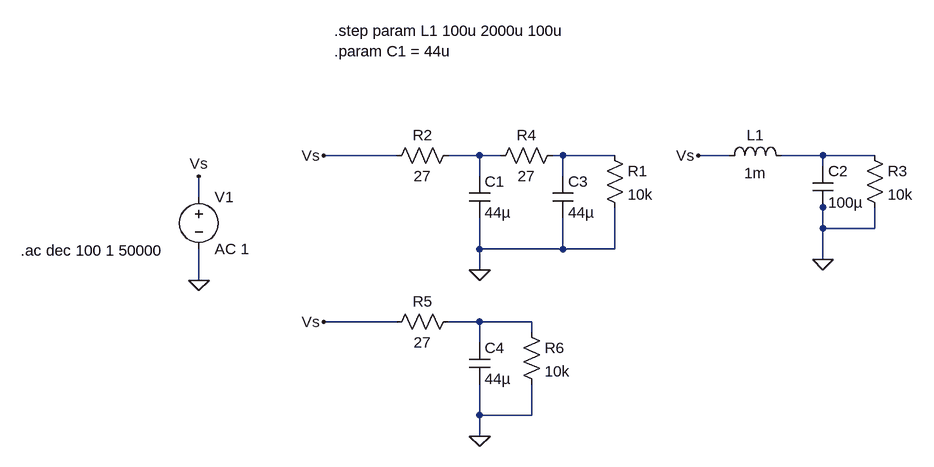
[diagram p0: schematic PowerFilter.asc]
PowerFilter.asc, the LTspice schematic file:
Version 4
SHEET 1 984 680
WIRE 112 48 0 48
WIRE 240 48 192 48
WIRE 272 48 240 48
WIRE 368 48 352 48
WIRE 448 48 368 48
WIRE 624 48 576 48
WIRE 768 48 704 48
WIRE 848 48 768 48
WIRE 768 64 768 48
WIRE 240 80 240 48
WIRE 368 80 368 48
WIRE -192 112 -192 80
WIRE 768 128 768 112
WIRE 768 160 768 128
WIRE 848 160 848 128
WIRE 848 160 768 160
WIRE 240 192 240 144
WIRE 368 192 368 144
WIRE 368 192 240 192
WIRE 448 192 448 128
WIRE 448 192 368 192
WIRE 768 208 768 160
WIRE 240 224 240 192
WIRE -192 240 -192 192
WIRE 112 304 0 304
WIRE 240 304 192 304
WIRE 320 304 240 304
WIRE 320 320 320 304
WIRE 240 336 240 304
WIRE 240 448 240 400
WIRE 320 448 320 400
WIRE 320 448 240 448
WIRE 240 480 240 448
FLAG 240 224 0
FLAG -192 240 0
FLAG -192 80 Vs
FLAG 0 48 Vs
FLAG 768 208 0
FLAG 576 48 Vs
FLAG 240 480 0
FLAG 0 304 Vs
SYMBOL voltage -192 96 R0
WINDOW 123 0 0 Left 2
WINDOW 39 0 0 Left 2
SYMATTR InstName V1
SYMATTR Value AC 1
SYMBOL cap 224 80 R0
SYMATTR InstName C1
SYMATTR Value 44µ
SYMBOL res 432 32 R0
SYMATTR InstName R1
SYMATTR Value 10k
SYMBOL res 208 32 R90
WINDOW 0 0 56 VBottom 2
WINDOW 3 32 56 VTop 2
SYMATTR InstName R2
SYMATTR Value 27
SYMBOL ind 608 64 R270
WINDOW 0 32 56 VTop 2
WINDOW 3 5 56 VBottom 2
SYMATTR InstName L1
SYMATTR Value 1m
SYMBOL cap 752 64 R0
SYMATTR InstName C2
SYMATTR Value 100µ
SYMBOL res 832 32 R0
SYMATTR InstName R3
SYMATTR Value 10k
SYMBOL res 368 32 R90
WINDOW 0 0 56 VBottom 2
WINDOW 3 32 56 VTop 2
SYMATTR InstName R4
SYMATTR Value 27
SYMBOL cap 352 80 R0
SYMATTR InstName C3
SYMATTR Value 44µ
SYMBOL cap 224 336 R0
SYMATTR InstName C4
SYMATTR Value 44µ
SYMBOL res 208 288 R90
WINDOW 0 0 56 VBottom 2
WINDOW 3 32 56 VTop 2
SYMATTR InstName R5
SYMATTR Value 27
SYMBOL res 304 304 R0
SYMATTR InstName R6
SYMATTR Value 10k
TEXT -466 194 Left 2 !.ac dec 100 1 50000
TEXT 16 -144 Left 2 !.step param L1 100u 2000u 100u\n.param C1 = 44u

The netlist it stands for:
* PowerFilter.asc
V1 Vs 0 AC 1
C1 N001 0 44µ
R1 N002 0 10k
R2 N001 Vs 27
L1 Vs N003 1m
C2 N003 0 100µ
R3 N003 0 10k
R4 N002 N001 27
C3 N002 0 44µ
C4 N004 0 44µ
R5 N004 Vs 27
R6 N004 0 10k
.ac dec 100 1 50000
.step param L1 100u 2000u 100u
.param C1 = 44u
.backanno
.end